# Altium schematic sheet can.SchDoc
size A4; SheetNumber: 4; SheetTotal: 6
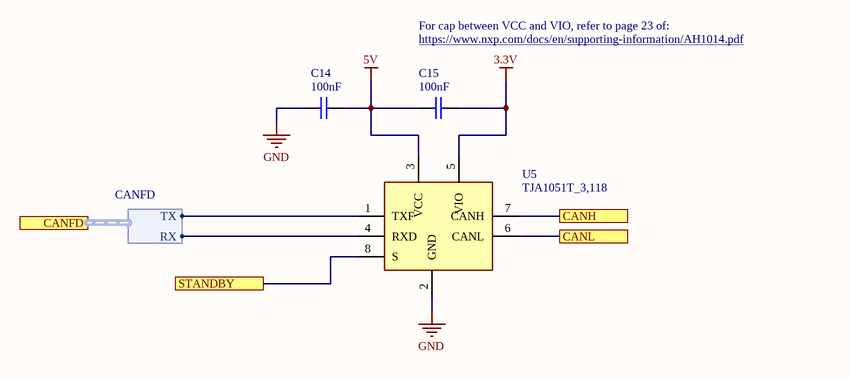
[diagram p0: can.SchDoc]

## Parts
C14  value 100nF  [0603 - Capacitor]  (hidden comment: Capacitor - Nonpolarized)
C15  value 100nF  [0603 - Capacitor]  (hidden comment: Capacitor - Nonpolarized)
U5  TJA1051T_3,118  [TJA1051T/3,118 - duplicate]

## Ports
CANFD (harness CANFD), CANH, CANL, STANDBY

## Harnesses
CANFD: RX, TX

## Nets
3.3V: C15.2 U5.5(VIO)
5V: C14.2 C15.1 U5.3(VCC)
GND: C14.1 U5.2(GND)
CANH: U5.7(CANH) ; port CANH
CANL: U5.6(CANL) ; port CANL
STANDBY: U5.8(S) ; port STANDBY
NetU5_1: U5.1(TXF) ; port CANFD.TX
NetU5_4: U5.4(RXD) ; port CANFD.RX

## Notes on the sheet
- For cap between VCC and VIO, refer to page 23 of:
- https://www.nxp.com/docs/en/supporting-information/AH1014.pdf

## Library data of the parts
C14 C15 = Capacitor - Nonpolarized: Nonpolarized Capacitor; Supplier Part Number: *; Supplier: *; Manufacturer: *; Rating: *; Manufacturer Part Number: *
U5 = TJA1051T_3,118: CAN Transceiver IC 4.5V-5.5V 250ns; Manufacturer: NXP; Manufacturer Part Number: TJA1051T/3,118; Supplier Part Number: 568-8684-1-ND; Supplier: Digikey; ComponentLink1Description: Datasheet; ComponentLink1URL: http://www.nxp.com/docs/en/data-sheet/TJA1051.pdf